# Altium schematic sheet STM8P32.SchDoc
size A4
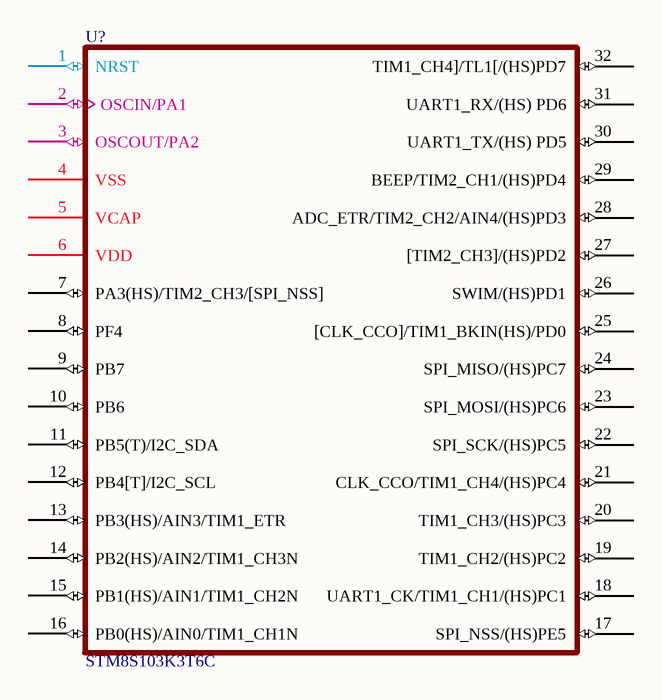
[diagram p0: STM8P32.SchDoc]

## Parts
U?  STM8S103K3T6C  [TQFP32]

## Nets

Not connected (* = marked no-connect by the designer): U? 1(NRST) 2(OSCIN/PA1) 3(OSCOUT/PA2) 4(VSS) 5(VCAP) 6(VDD) 7(PA3(HS)/TIM2_CH3/[SPI_NSS]) 8(PF4) 9(PB7) 10(PB6) 11(PB5(T)/I2C_SDA) 12(PB4[T]/I2C_SCL) 13(PB3(HS)/AIN3/TIM1_ETR) 14(PB2(HS)/AIN2/TIM1_CH3N) 15(PB1(HS)/AIN1/TIM1_CH2N) 16(PB0(HS)/AIN0/TIM1_CH1N) 17(SPI_NSS/(HS)PE5) 18(UART1_CK/TIM1_CH1/(HS)PC1) 19(TIM1_CH2/(HS)PC2) 20(TIM1_CH3/(HS)PC3) 21(CLK_CCO/TIM1_CH4/(HS)PC4) 22(SPI_SCK/(HS)PC5) 23(SPI_MOSI/(HS)PC6) 24(SPI_MISO/(HS)PC7) 25([CLK_CCO]/TIM1_BKIN(HS)/PD0) 26(SWIM/(HS)PD1) 27([TIM2_CH3]/(HS)PD2) 28(ADC_ETR/TIM2_CH2/AIN4/(HS)PD3) 29(BEEP/TIM2_CH1/(HS)PD4) 30(UART1_TX/(HS)_PD5) 31(UART1_RX/(HS)_PD6) 32(TIM1_CH4]/TL1[/(HS)PD7)

## Library data of the parts
U? = STM8S103K3T6: ST 8-bit  Microcontroller